# EAGLE design DMDConnector (EAGLE 6.5.0)
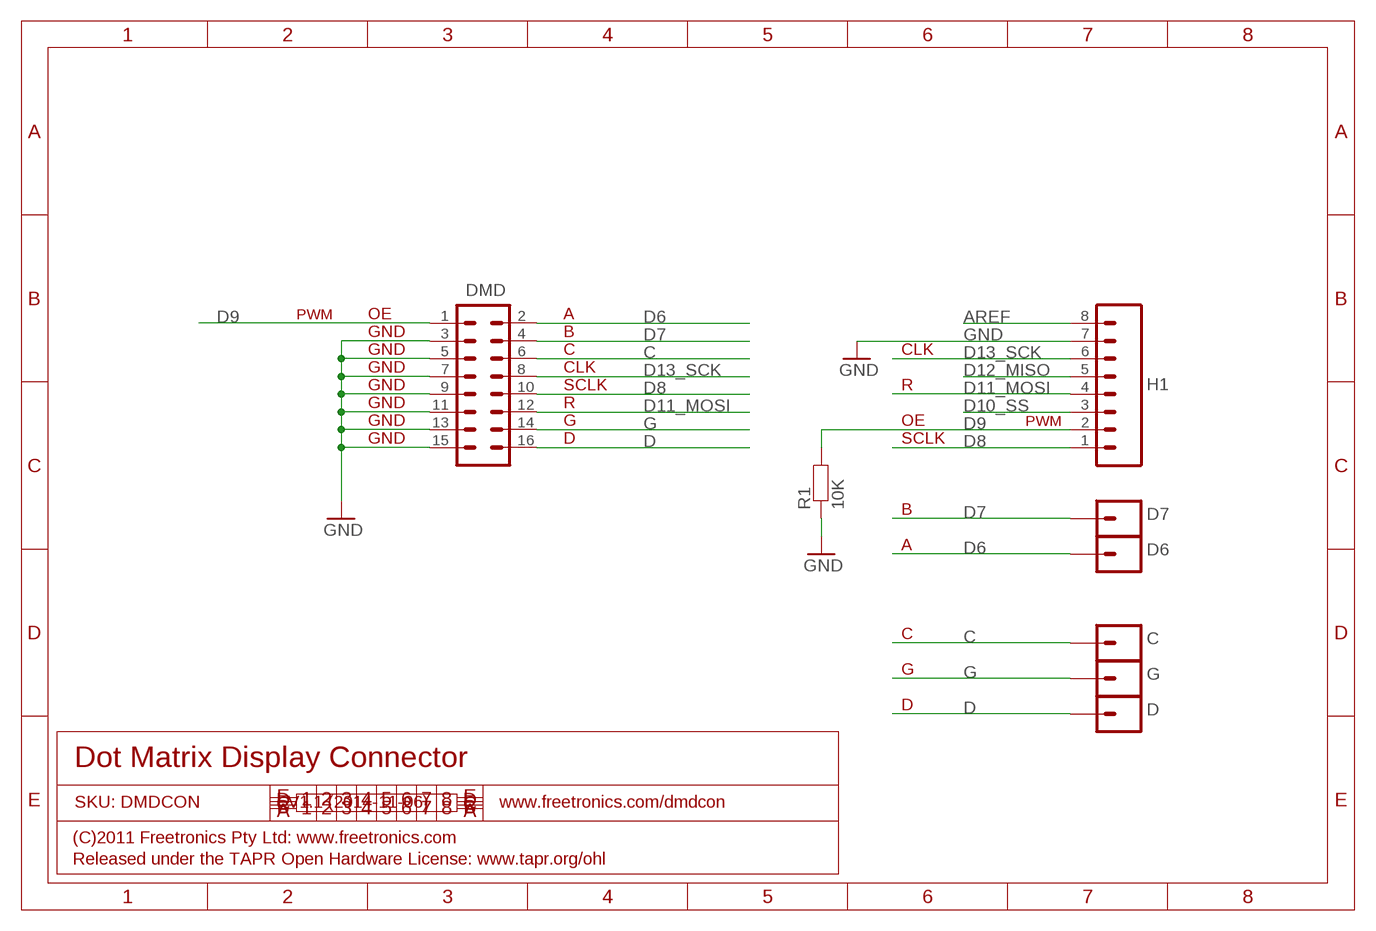
[diagram p0: schematic, sheet 1]

## Parts
C  M01PTH  [1X01]
D  M01PTH  [1X01]
D6  M01PTH  [1X01]
D7  M01PTH  [1X01]
DMD  M08X2  M08X2SMALLERPADS  [2X8-SMALLERPADS]
G  M01PTH  [1X01]
H1  Digital_8_13  M08  [1X08]
R1  10K  RESISTOR0805  [0805]

## Nets
AREF: H1.8
C: C.1 DMD.6
D: D.1 DMD.16
D6: D6.1 DMD.2
D7: D7.1 DMD.4
D8: DMD.10 H1.1
D9: DMD.1 H1.2 R1.2
D10_SS: H1.3
D11_MOSI: DMD.12 H1.4
D12_MISO: H1.5
D13_SCK: DMD.8 H1.6
G: DMD.14 G.1
GND: DMD.3 DMD.5 DMD.7 DMD.9 DMD.11 DMD.13 DMD.15 H1.7 R1.1

## Notes on the sheet
- PWM | OE | A
- GND | B
- GND | C | CLK
- GND | CLK
- GND | SCLK | R
- GND | R
- GND | G | OE | PWM
- GND | D | SCLK
- B
- A
- C
- G
- D
- Dot Matrix Display Connector
- SKU: DMDCON | V1.1 (2014-11-06) | www.freetronics.com/dmdcon
- (C)2011 Freetronics Pty Ltd: www.freetronics.com
- Released under the TAPR Open Hardware License: www.tapr.org/ohl

## Library data of the parts
C D D6 D7 G = freetronics-master-v1:M01: Header 1 Standard 1-pin 0.1" header. Use with straight break away headers (SKU : PRT-00116), right angle break away headers (PRT-00553), swiss pins (PRT-00743), machine pins (PRT-00117), and female headers (PRT-00115).
DMD = freetronics-master-v1:M08X2
H1 = freetronics:M08: Header 8 Standard 8-pin 0.1" header. Use with straight break away headers (SKU : PRT-00116), right angle break away headers (PRT-00553), swiss pins (PRT-00743), machine pins (PRT-00117), and female headers (PRT-00115).
R1 = freetronics-master-v1.1:RESISTOR: Resistor Basic schematic elements and footprints for 0603, 1206, and PTH 1/10th watt (small) resistors.

## Board
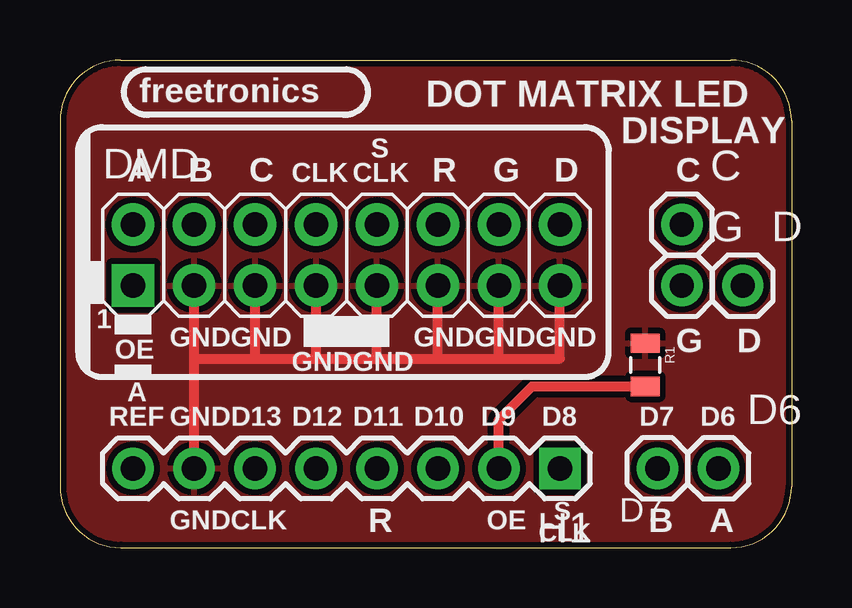
[diagram p1: board, top side]
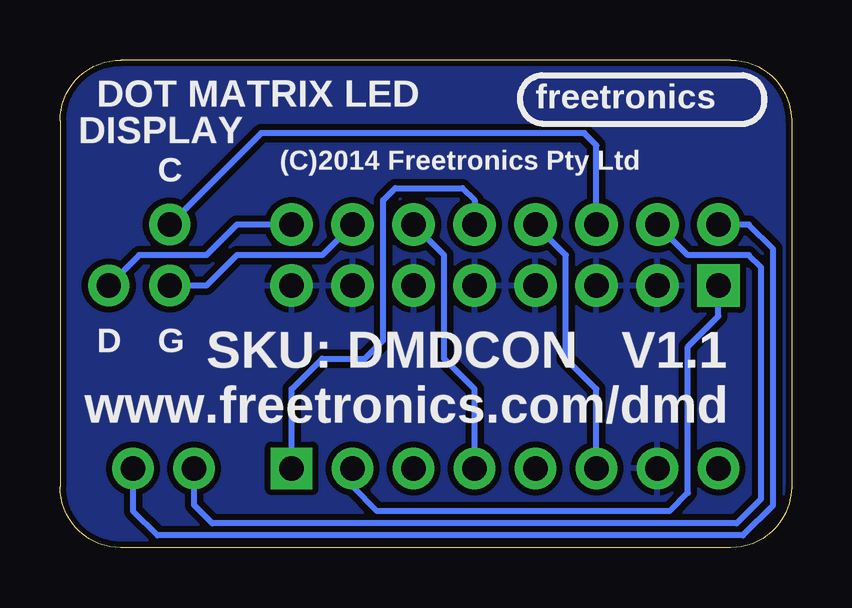
[diagram p2: board, bottom side, seen from below]

Size 30.48 x 20.32 mm. Coordinates in mm from the lower left corner, seen from the top.
Outline: 0,2.54 arc90 2.54,0 27.94,0 arc90 30.48,2.54 30.48,17.78 arc90 27.94,20.32 2.54,20.32 arc90 0,17.78 0,2.54
Copper layers (1*16): Top 0.035mm / dielectric 1.5mm / Bottom 0.035mm
Design rules "default *": minimum track width 8mil, minimum drill 15mil, track to track 10mil, track to pad 10mil, pad to pad 10mil, via to via 10mil, smd to smd 8mil, copper to edge 10mil, drill to drill 8mil, minimum pad ring 14mil, minimum via ring 8mil, stop-mask expansion 4mil, vias tented up to drill 25mil, thermal gap 10mil

### Footprints (pad centres in the part's own frame; a part is rotated, then mirrored left to right if it is on the bottom)
1X01 = drill 1.016: 1 0,0
2X8-SMALLERPADS = drill 1.016 pad 1.778 square: 1 0,0 | drill 1.016 pad 1.778: 2 0,2.54; 3 2.54,0; 4 2.54,2.54; 5 5.08,0; 6 5.08,2.54; 7 7.62,0; 8 7.62,2.54; 9 10.16,0; 10 10.16,2.54; 11 12.7,0; 12 12.7,2.54; 13 15.24,0; 14 15.24,2.54; 15 17.78,0; 16 17.78,2.54
1X08 = drill 1.016 square: 1 0,0 | drill 1.016: 2 2.54,0; 3 5.08,0; 4 7.62,0; 5 10.16,0; 6 12.7,0; 7 15.24,0; 8 17.78,0
0805 = smd 0.8 x 1.2: 1 -0.9,0; 2 0.9,0

### Placement (x,y rotation side)
C  25.91,13.46 0 top
D  28.45,10.92 0 top
D6  27.43,3.3 0 top
D7  24.89,3.3 0 top
DMD  3.05,10.92 0 top
G  25.91,10.92 0 top
H1  20.83,3.3 180 top
R1  24.38,7.62 270 top

### Tracks (layer width: path | path; a pad name or v marks a point on that pad's centre or on a via)
C
  Bottom 0.254: DMD.6 8.13,16.76 8.64,17.27 22.1,17.27 C.1
D
  Bottom 0.254: D.1 27.18,12.19 24.38,12.19 23.11,13.46 DMD.16
D6
  Bottom 0.254: D6.1 27.43,1.52 26.42,0.51 2.03,0.51 0.76,1.78 0.76,12.45 1.78,13.46 DMD.2
D7
  Bottom 0.254: D7.1 24.89,1.78 24.13,1.02 2.29,1.02 1.27,2.03 1.27,11.68 1.78,12.19 4.32,12.19 DMD.4
D8
  Bottom 0.254: H1.1 20.83,6.6 19.56,7.87 17.78,7.87 17.02,8.64 17.02,14.48 16.51,14.99 13.72,14.99 13.21,14.48 DMD.10
D9
  Top 0.406: H1.2 18.29,5.33 19.67,6.72 R1.2
  Bottom 0.254: H1.2 18.29,2.54 17.27,1.52 5.08,1.52 4.32,2.29 4.32,8.38 3.05,9.65 DMD.1
D11_MOSI
  Bottom 0.254: H1.4 13.21,6.6 14.48,7.87 14.48,12.19 DMD.12
D13_SCK
  Bottom 0.254: H1.6 8.13,6.6 9.4,7.87 9.4,12.19 DMD.8
G
  Bottom 0.254: DMD.14 19.56,12.19 23.11,12.19 24.38,10.92 G.1
GND
  Top 0.406: 5.59,7.87 DMD.3 | 5.59,7.87 8.13,7.87 | 8.13,7.87 10.67,7.87 | 10.67,7.87 13.08,7.87 | 13.08,7.87 15.62,7.87 | 15.62,7.87 18.29,7.87 | 18.29,7.87 20.83,7.87 DMD.15 | 18.29,7.87 DMD.13 | DMD.11 15.75,8 15.62,7.87 | DMD.9 13.21,8 13.08,7.87 | 10.67,7.87 DMD.7 | 8.13,7.87 DMD.5 | H1.7 5.59,7.87
  pour Top: 0,17.78 arc-90 2.54,20.32 27.94,20.32 arc-90 30.48,17.78 30.48,17.53 30.48,2.54 arc-90 27.94,0 2.54,0 arc-90 0,2.54
  pour Bottom: 0,17.78 arc-90 2.54,20.32 27.94,20.32 arc-90 30.48,17.78 30.48,2.54 arc-90 27.94,0 2.54,0 arc-90 0,2.54

### Text on the board
tPlace: freetronics | DOT MATRIX LED | DISPLAY | S | A | B | C | CLK | CLK | R | G | D | C | 1 | OE | GND | GND | GND | GND | GND | G | D | GND | GND | A | REF | GND | D13 | D12 | D11 | D10 | D9 | D8 | D7 | D6 | GND | CLK | R | OE | S | B | A | CLK
bPlace: freetronics | DOT MATRIX LED | DISPLAY | (C)2014 Freetronics Pty Ltd | C | G | D | SKU: DMDCON V1.1 | www.freetronics.com/dmd